# EAGLE design HalfMegCoCo_ZIP (EAGLE 7.7.0)
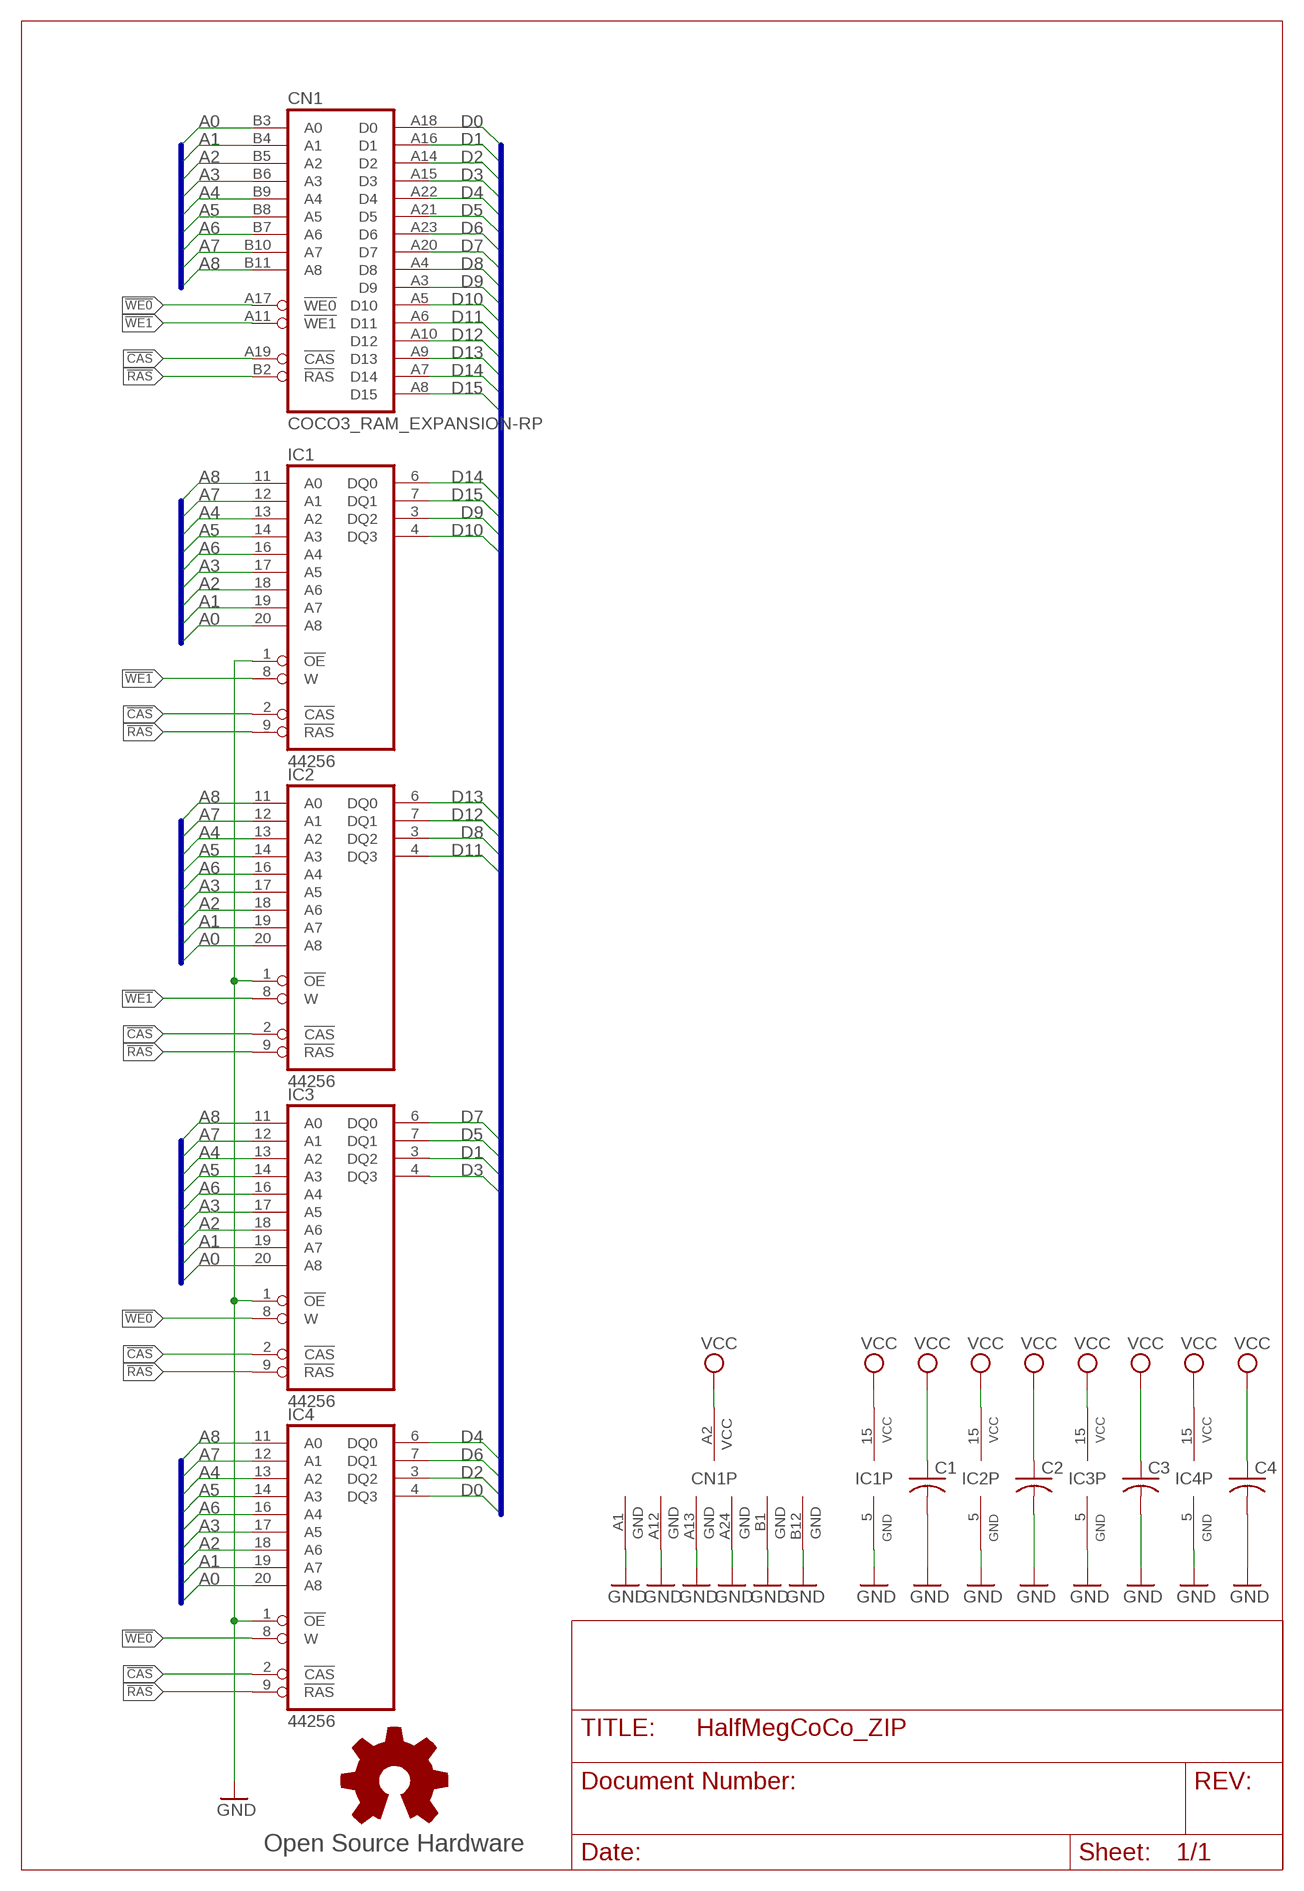
[diagram p0: schematic, sheet 1]

## Parts
C1  C-US025-025X050  [C025-025X050]
C2  C-US025-025X050  [C025-025X050]
C3  C-US025-025X050  [C025-025X050]
C4  C-US025-025X050  [C025-025X050]
CN1  COCO3_RAM_EXPANSION-RP  [RAM_EXPANSION-RP]
GOLD_ORB_SM1  Open Source Hardware  OSHWLOGOLOGO8MM  [OSHW_8MM]
IC1  44256  44256L  [ZIP20]
IC2  44256  44256L  [ZIP20]
IC3  44256  44256L  [ZIP20]
IC4  44256  44256L  [ZIP20]

## Nets
!CAS: CN1.A19(!CAS) IC1.2(!CAS) IC2.2(!CAS) IC3.2(!CAS) IC4.2(!CAS)
!RAS: CN1.B2(!RAS) IC1.9(!RAS) IC2.9(!RAS) IC3.9(!RAS) IC4.9(!RAS)
!WE0: CN1.A17(!WE0) IC3.8(W) IC4.8(W)
!WE1: CN1.A11(!WE1) IC1.8(W) IC2.8(W)
A0: CN1.B3(A0) IC1.20(A8) IC2.20(A8) IC3.20(A8) IC4.20(A8)
A1: CN1.B4(A1) IC1.19(A7) IC2.19(A7) IC3.19(A7) IC4.19(A7)
A2: CN1.B5(A2) IC1.18(A6) IC2.18(A6) IC3.18(A6) IC4.18(A6)
A3: CN1.B6(A3) IC1.17(A5) IC2.17(A5) IC3.17(A5) IC4.17(A5)
A4: CN1.B9(A4) IC1.13(A2) IC2.13(A2) IC3.13(A2) IC4.13(A2)
A5: CN1.B8(A5) IC1.14(A3) IC2.14(A3) IC3.14(A3) IC4.14(A3)
A6: CN1.B7(A6) IC1.16(A4) IC2.16(A4) IC3.16(A4) IC4.16(A4)
A7: CN1.B10(A7) IC1.12(A1) IC2.12(A1) IC3.12(A1) IC4.12(A1)
A8: CN1.B11(A8) IC1.11(A0) IC2.11(A0) IC3.11(A0) IC4.11(A0)
D0: CN1.A18(D0) IC4.4(DQ3)
D1: CN1.A16(D1) IC3.3(DQ2)
D2: CN1.A14(D2) IC4.3(DQ2)
D3: CN1.A15(D3) IC3.4(DQ3)
D4: CN1.A22(D4) IC4.6(DQ0)
D5: CN1.A21(D5) IC3.7(DQ1)
D6: CN1.A23(D6) IC4.7(DQ1)
D7: CN1.A20(D7) IC3.6(DQ0)
D8: CN1.A4(D8) IC2.3(DQ2)
D9: CN1.A3(D9) IC1.3(DQ2)
D10: CN1.A5(D10) IC1.4(DQ3)
D11: CN1.A6(D11) IC2.4(DQ3)
D12: CN1.A10(D12) IC2.7(DQ1)
D13: CN1.A9(D13) IC2.6(DQ0)
D14: CN1.A7(D14) IC1.6(DQ0)
D15: CN1.A8(D15) IC1.7(DQ1)
GND: C1.2 C2.2 C3.2 C4.2 CN1.A1(GND) CN1.A12(GND) CN1.A13(GND) CN1.A24(GND) CN1.B1(GND) CN1.B12(GND) IC1.1(!OE) IC1.5(GND) IC2.1(!OE) IC2.5(GND) IC3.1(!OE) IC3.5(GND) IC4.1(!OE) IC4.5(GND)
VCC: C1.1 C2.1 C3.1 C4.1 CN1.A2(VCC) IC1.15(VCC) IC2.15(VCC) IC3.15(VCC) IC4.15(VCC)

## Buses
D[0..15]
A[0..8]

## Library data of the parts
C1-C4 = rcl:C-US: CAPACITOR, American symbol
CN1 = coco:COCO3_RAM_EXPANSION
GOLD_ORB_SM1 = oshw:OSHWLOGO: The OSHW logo for PCB layout
IC1-IC4 = memory-jlb:44256

## Board
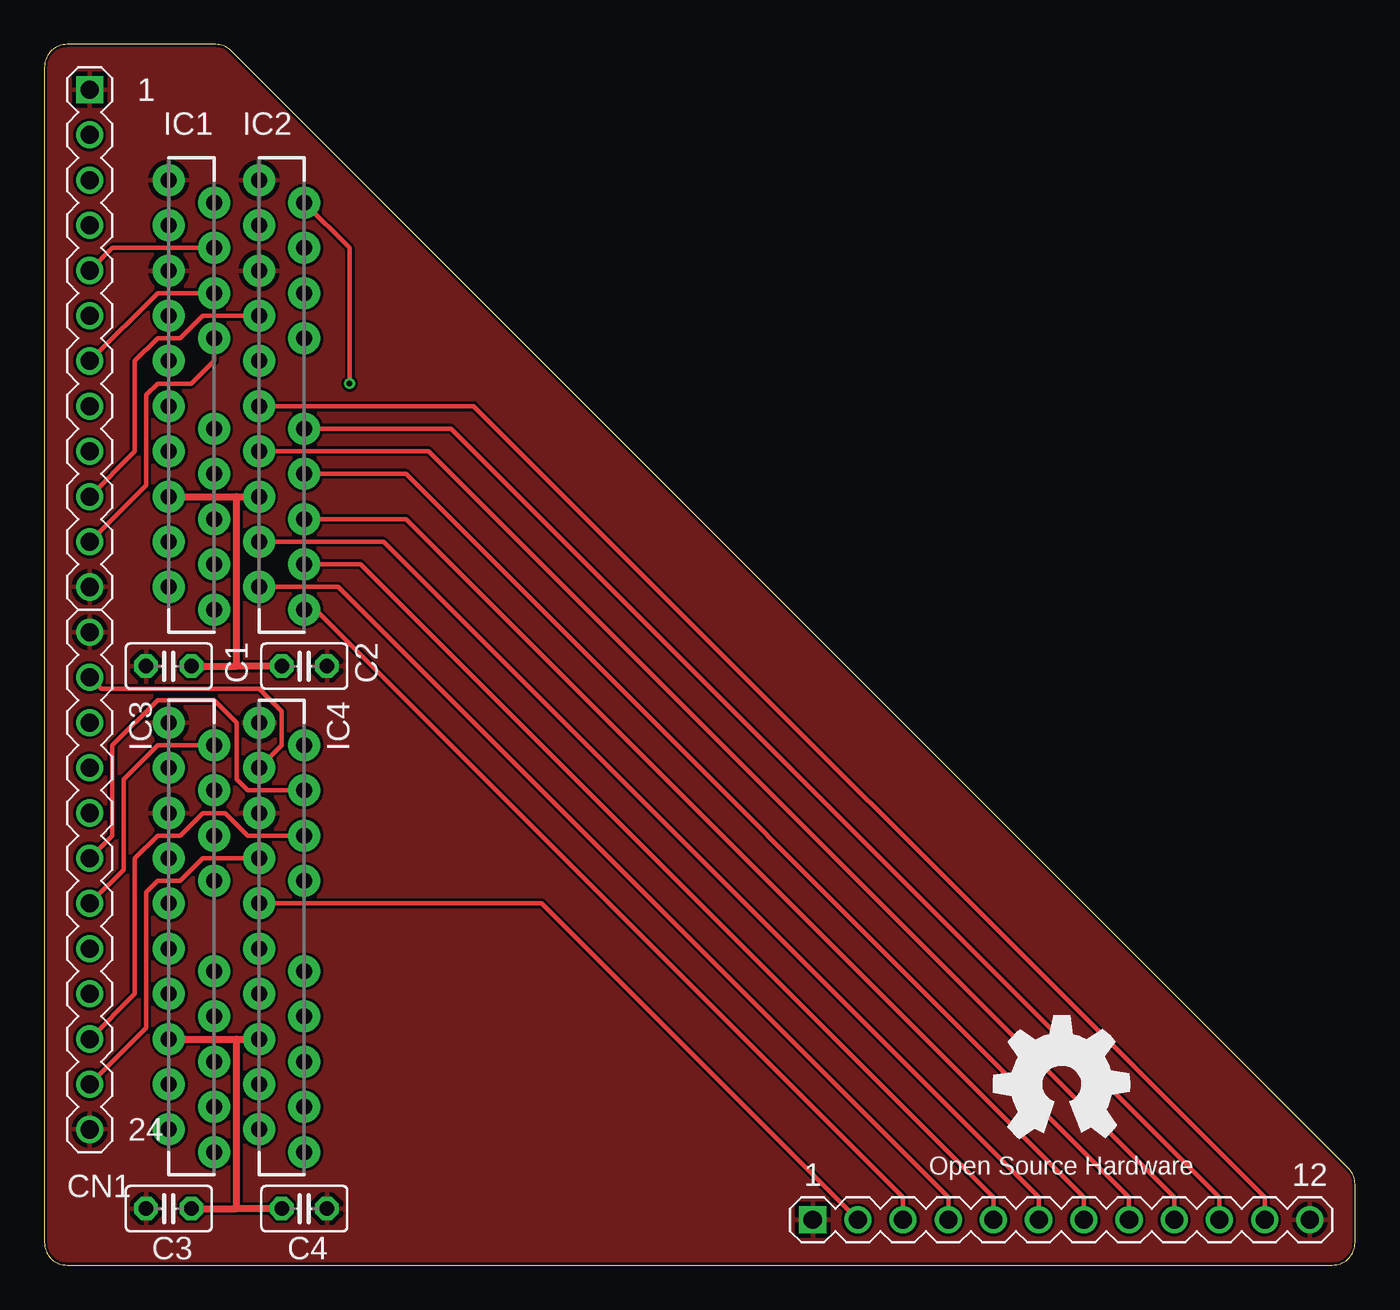
[diagram p1: board, top side]
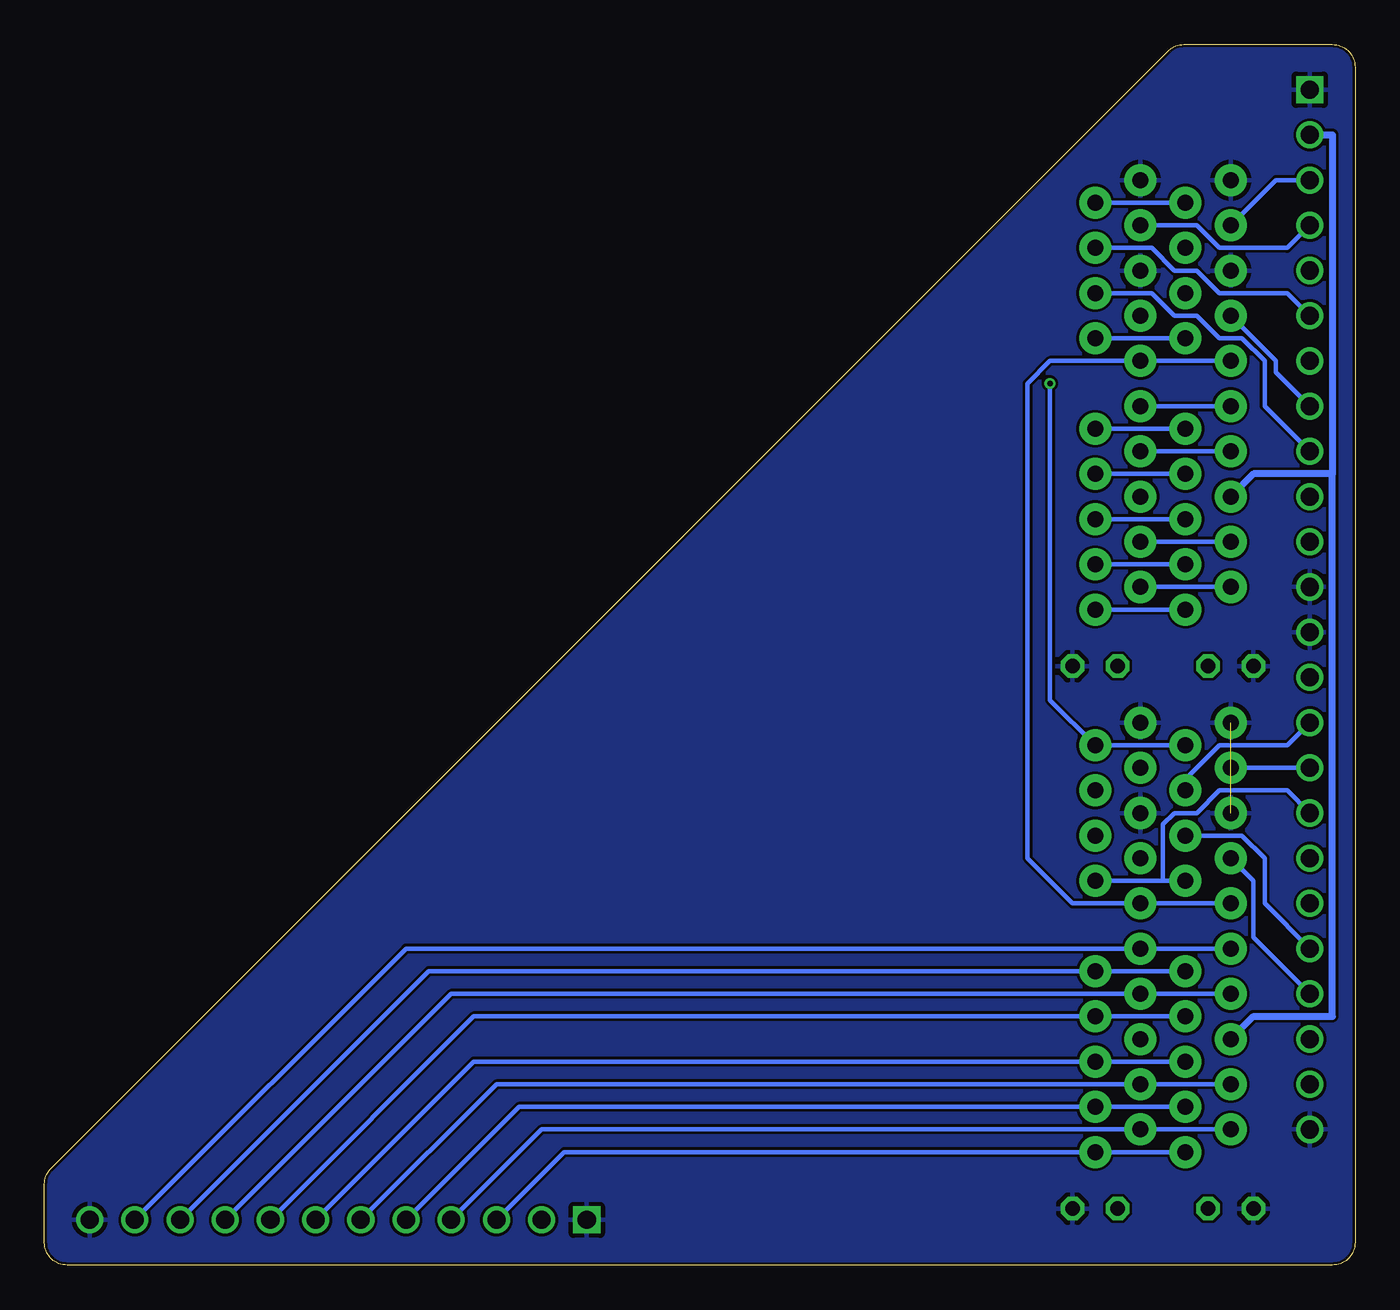
[diagram p2: board, bottom side, seen from below]

Size 73.66 x 68.58 mm. Coordinates in mm from the lower left corner, seen from the top.
Outline: 0,67.31 0,1.27 arc90 1.27,0 72.39,0 arc90 73.66,1.27 73.66,4.55 arc45 73.29,5.45 10.53,68.21 arc45 9.63,68.58 1.27,68.58 arc90 0,67.31
Copper layers (1*16): Top 0.035mm / dielectric 1.5mm / Bottom 0.035mm
Design rules "hackvana *": minimum track width 6mil, minimum drill 0.3mm, track to track 6mil, track to pad 6mil, pad to pad 6mil, via to via 6mil, smd to smd 0mil, copper to edge 6mil, drill to drill 6mil, minimum pad ring 10mil, minimum via ring 6mil, stop-mask expansion 2mil, vias tented up to drill 100mil, thermal gap 10mil

### Footprints (pad centres in the part's own frame; a part is rotated, then mirrored left to right if it is on the bottom)
C025-025X050 = drill 0.813 octagon: 1 -1.27,0; 2 1.27,0
RAM_EXPANSION-RP = drill 1.016 square: A1 -34.29,31.75; B1 6.35,-31.75 | drill 1.016: A2 -34.29,29.21; A3 -34.29,26.67; A4 -34.29,24.13; A5 -34.29,21.59; A6 -34.29,19.05; A7 -34.29,16.51; A8 -34.29,13.97; A9 -34.29,11.43; A10 -34.29,8.89; A11 -34.29,6.35; A12 -34.29,3.81; A13 -34.29,1.27; A14 -34.29,-1.27; A15 -34.29,-3.81; A16 -34.29,-6.35; A17 -34.29,-8.89; A18 -34.29,-11.43; A19 -34.29,-13.97; A20 -34.29,-16.51; A21 -34.29,-19.05; A22 -34.29,-21.59; A23 -34.29,-24.13; A24 -34.29,-26.67; B2 8.89,-31.75; B3 11.43,-31.75; B4 13.97,-31.75; B5 16.51,-31.75; B6 19.05,-31.75; B7 21.59,-31.75; B8 24.13,-31.75; B9 26.67,-31.75; B10 29.21,-31.75; B11 31.75,-31.75; B12 34.29,-31.75
ZIP20 = drill 0.9 pad 1.8: 1 -11.43,-1.27; 2 -10.16,1.27; 3 -8.89,-1.27; 4 -7.62,1.27; 5 -6.35,-1.27; 6 -5.08,1.27; 7 -3.81,-1.27; 8 -2.54,1.27; 9 -1.27,-1.27; 11 1.27,-1.27; 12 2.54,1.27; 13 3.81,-1.27; 14 5.08,1.27; 15 6.35,-1.27; 16 7.62,1.27; 17 8.89,-1.27; 18 10.16,1.27; 19 11.43,-1.27; 20 12.7,1.27

### Placement (x,y rotation side)
C1  6.99,33.66 180 top
C2  14.61,33.66 0 top
C3  6.99,3.17 180 top
C4  14.61,3.17 0 top
CN1  36.83,34.29 0 top
GOLD_ORB_SM1  57.15,10.16 0 top
IC1  8.26,49.53 270 top
IC2  13.34,49.53 270 top
IC3  8.26,19.05 270 top
IC4  13.34,19.05 270 top

### Tracks (layer width: path | path; a pad name or v marks a point on that pad's centre or on a via)
!CAS  (via drill 0.3)
  Top 0.254: CN1.A19 4.45,22.23 4.45,27.3 6.35,29.21 IC3.2 | IC2.2 17.14,57.15 v17.14,49.53
  Bottom 0.254: IC3.2 IC4.2 17.14,31.75 v17.14,49.53 | IC2.2 IC1.2
!RAS
  Top 0.254: IC4.9 27.94,20.32 CN1.B2
  Bottom 0.254: IC3.9 IC4.9 15.88,20.32 18.41,22.86 18.41,49.53 17.14,50.8 IC2.9 IC1.9
!WE0
  Bottom 0.254: IC3.8 10.79,21.59 | 10.79,21.59 IC4.8 | CN1.A17 3.81,26.67 7.62,26.67 8.89,25.4 10.16,25.4 10.79,24.77 10.79,21.59
!WE1
  Top 0.254: CN1.A11 5.71,43.81 5.71,48.9 6.35,49.53 8.26,49.53 9.53,50.8 IC1.8
  Bottom 0.254: IC1.8 IC2.8
A0
  Top 0.254: CN1.B3 48.26,3.81 15.24,36.83 IC2.20
  Bottom 0.254: IC3.20 IC4.20 44.45,6.35 CN1.B3 | IC1.20 IC2.20
A1
  Top 0.254: IC2.19 16.51,38.1 50.8,3.81 CN1.B4
  Bottom 0.254: IC3.19 IC4.19 45.72,7.62 CN1.B4 | IC2.19 IC1.19
A2
  Top 0.254: CN1.B5 53.34,3.81 17.78,39.37 IC2.18
  Bottom 0.254: IC3.18 IC4.18 46.99,8.89 CN1.B5 | IC2.18 IC1.18
A3
  Top 0.254: CN1.B6 55.88,3.81 19.05,40.64 IC2.17
  Bottom 0.254: IC3.17 IC4.17 48.26,10.16 CN1.B6 | IC1.17 IC2.17
A4
  Top 0.254: CN1.B9 63.5,3.81 21.59,45.72 IC2.13
  Bottom 0.254: IC3.13 IC4.13 50.8,15.24 CN1.B9 | IC1.13 IC2.13
A5
  Top 0.254: CN1.B8 60.96,3.81 20.32,44.45 IC2.14
  Bottom 0.254: IC3.14 IC4.14 49.53,13.97 CN1.B8 | IC1.14 IC2.14
A6
  Top 0.254: CN1.B7 58.42,3.81 20.32,41.91 IC2.16
  Bottom 0.254: IC3.16 IC4.16 49.53,11.43 CN1.B7 | IC1.16 IC2.16
A7
  Top 0.254: CN1.B10 66.04,3.81 22.86,46.99 IC2.12
  Bottom 0.254: IC3.12 IC4.12 52.07,16.51 CN1.B10 | IC1.12 IC2.12
A8
  Top 0.254: IC2.11 24.13,48.26 68.58,3.81 CN1.B11
  Bottom 0.254: IC3.11 IC4.11 53.34,17.78 CN1.B11 | IC2.11 IC1.11
D0
  Top 0.254: IC4.4 11.43,26.67 10.79,27.3 10.79,30.48 9.53,31.75 6.35,31.75 3.81,29.21 3.81,24.13 CN1.A18
D1
  Bottom 0.254: CN1.A16 IC3.3
D2
  Top 0.254: IC4.3 13.34,29.21 13.34,31.11 12.06,32.38 3.17,32.38 CN1.A14
D3
  Bottom 0.254: IC3.4 9.53,27.3 7.62,29.21 3.81,29.21 CN1.A15
D4
  Top 0.254: CN1.A22 5.08,15.24 5.08,22.86 6.35,24.13 7.62,24.13 8.89,25.4 10.16,25.4 11.43,24.13 IC4.6
D5
  Bottom 0.254: CN1.A21 5.71,18.41 5.71,21.59 IC3.7
D6
  Top 0.254: CN1.A23 5.71,13.34 5.71,20.95 6.35,21.59 7.62,21.59 8.89,22.86 IC4.7
D7
  Bottom 0.254: CN1.A20 5.08,20.32 5.08,22.86 6.35,24.13 IC3.6
D8
  Bottom 0.254: CN1.A4 3.81,57.15 7.62,57.15 8.89,58.42 IC2.3
D9
  Bottom 0.254: CN1.A3 4.45,60.96 IC1.3
D10
  Top 0.254: CN1.A5 3.81,57.15 IC1.4
D11
  Bottom 0.254: CN1.A6 3.81,54.61 7.62,54.61 8.89,55.88 10.16,55.88 11.43,57.15 IC2.4
D12
  Top 0.254: CN1.A10 5.08,45.72 5.08,50.8 6.35,52.07 7.62,52.07 8.89,53.34 IC2.7
D13
  Bottom 0.254: CN1.A9 5.08,48.26 5.08,50.8 6.35,52.07 7.62,52.07 8.89,53.34 10.16,53.34 11.43,54.61 IC2.6
D14
  Top 0.254: IC1.6 6.35,54.61 CN1.A7
D15
  Bottom 0.254: CN1.A8 4.45,50.16 4.45,50.8 IC1.7
GND  (1 unrouted)
  pour Bottom: 72.39,0 1.27,0 arc-90 0,1.27 0,67.31 arc-90 1.27,68.58 9.63,68.58 arc-45 10.53,68.21 73.29,5.45 arc-45 73.66,4.55 73.66,1.27 arc-90
  pour Top: 72.39,0 1.27,0 arc-90 0,1.27 0,67.31 arc-90 1.27,68.58 9.63,68.58 arc-45 10.53,68.21 73.29,5.45 arc-45 73.66,4.55 73.66,1.27 arc-90
VCC
  Top 0.406: IC1.15 10.79,43.18 | 10.79,43.18 IC2.15 | IC3.15 10.79,12.7 | C3.1 10.79,3.17 | 10.79,3.17 10.79,12.7 | C4.1 10.79,3.17 | 10.79,12.7 IC4.15 | C2.1 10.79,33.66 | 10.79,33.66 10.79,43.18 | C1.1 10.79,33.66
  Bottom 0.406: CN1.A2 1.27,63.5 1.27,44.45 | 1.27,44.45 5.71,44.45 IC1.15 | IC3.15 5.71,13.97 1.27,13.97 1.27,44.45